# Altium project obdh2_project.prjpcb (part 2 of 2)
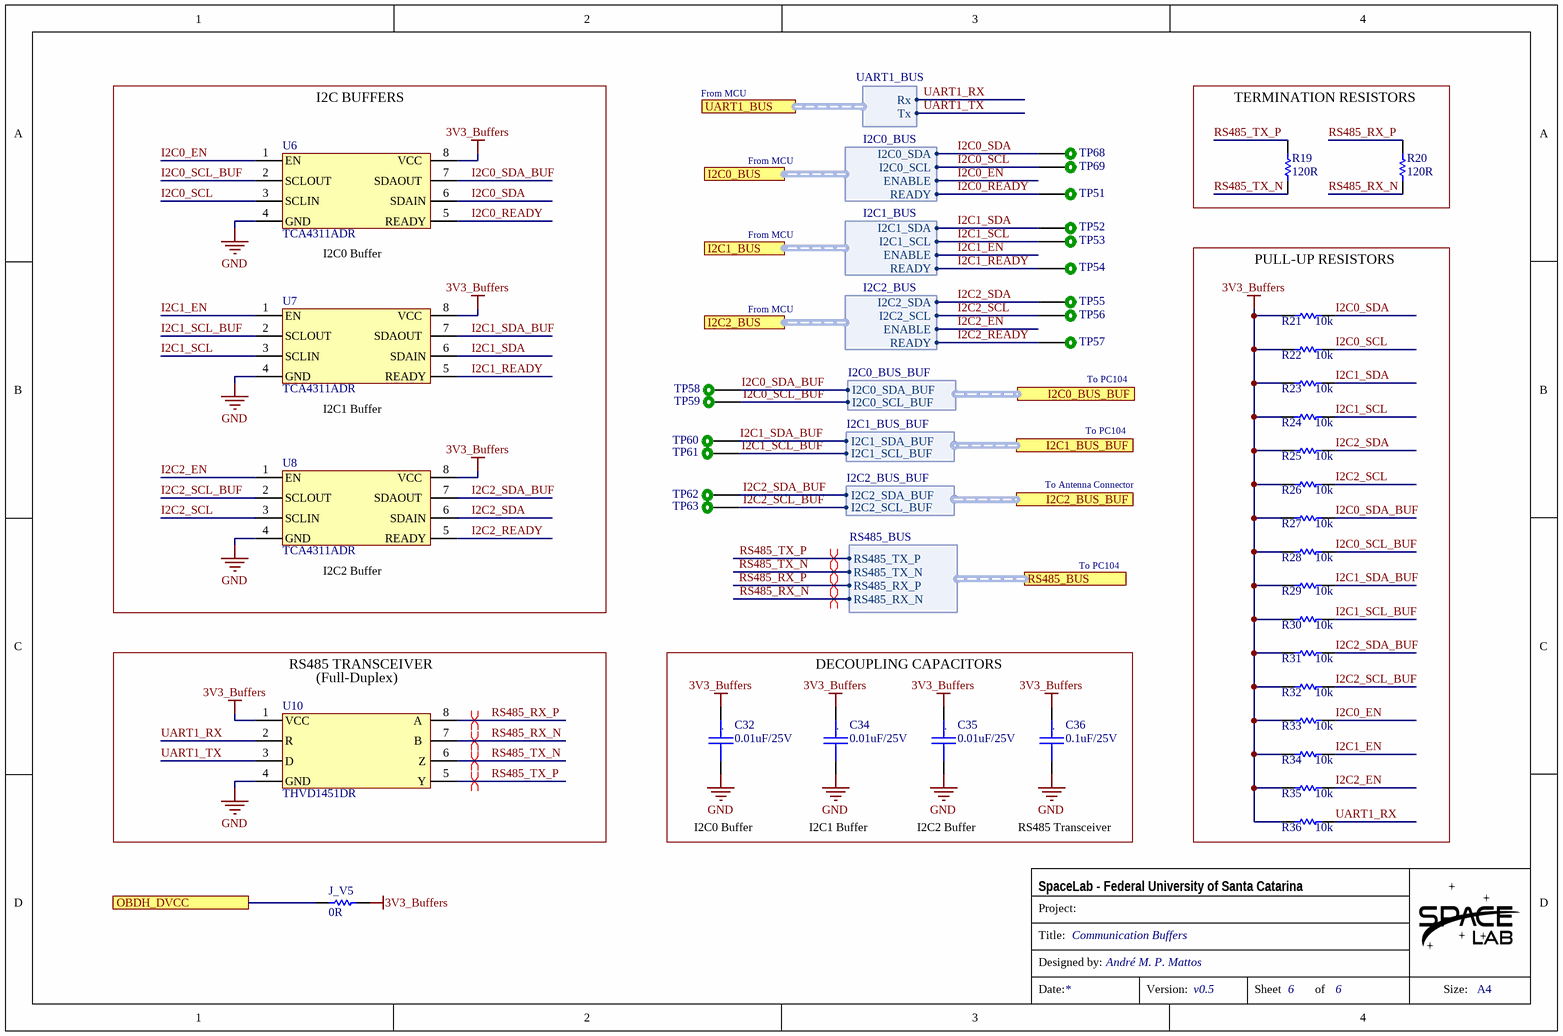
[diagram p7: 6_communication_buffers.schdoc]

## Nets that join several sheets
AGND: 3_mcu_main (U9.10 U9.12 U9.15 U9.83), 4_analog_circuits (20 pins)
ANTENNA_VCC: 1_interface (7 pins), 4_analog_circuits (C23.1 C24.1 R12.2 TP44.1)
GND: 0_architecture (MEC8.0), 1_interface (16 pins), 3_mcu_main (19 pins), 4_analog_circuits (15 pins), 5_non_volatile_memory (7 pins), 6_communication_buffers (8 pins)
OBDH_AVCC: 3_mcu_main (U9.11), 4_analog_circuits (12 pins)
OBDH_DVCC: 1_interface (P3.1), 3_mcu_main (6 pins), 4_analog_circuits (14 pins), 5_non_volatile_memory (J_V4.2), 6_communication_buffers (J_V5.2)
~{MR}_WDOG: 3_mcu_main (TP8.1 U9.75), 4_analog_circuits (R38.2 U1.3)
ANTENNA_GPIO: 1_interface (P4.5 P5.5), 3_mcu_main (U9.67)
COMMON_VCC: 1_interface (J_V0.2 P6.2), 4_analog_circuits (C13.1 RSense.1 TP45.1)
D_BOARD_ADC0: 1_interface (P3.12), 3_mcu_main (U9.97)
D_BOARD_ADC1: 1_interface (P3.14), 3_mcu_main (U9.98)
D_BOARD_ADC2: 1_interface (P3.16), 3_mcu_main (TP37.1 U9.99)
D_BOARD_GPIO0: 1_interface (P3.7), 3_mcu_main (U9.5)
D_BOARD_GPIO1: 1_interface (P3.8), 3_mcu_main (U9.6)
D_BOARD_GPIO2: 1_interface (P3.9), 3_mcu_main (TP35.1 U9.7)
D_BOARD_GPIO3: 1_interface (P3.10), 3_mcu_main (TP36.1 U9.8)
D_BOARD_SPI_CS0: 1_interface (P3.17), 3_mcu_main (TP38.1 U9.2)
D_BOARD_SPI_CS1: 1_interface (P3.19), 3_mcu_main (TP39.1 U9.3)
ESD: 0_architecture (MEC4.0), 1_interface (R_ESD.2)
FRAM_SPI_CS: 3_mcu_main (U9.69), 5_non_volatile_memory (R39.1 U11.1)
FRAM_WP: 3_mcu_main (U9.68), 5_non_volatile_memory (R40.1 U11.3)
I2C0_EN: 3_mcu_main (U9.42), 6_communication_buffers (R33.1 U6.1)
I2C0_READY: 3_mcu_main (U9.45), 6_communication_buffers (TP51.1 U6.5)
I2C0_SCL: 3_mcu_main (U9.19), 6_communication_buffers (R22.1 TP69.1 U6.3)
I2C0_SCL_BUF: 1_interface (J_PC2.2 U16.H1-43), 6_communication_buffers (R28.1 TP59.1 U6.2)
I2C0_SDA: 3_mcu_main (U9.18), 6_communication_buffers (R21.1 TP68.1 U6.6)
I2C0_SDA_BUF: 1_interface (J_PC1.2 U16.H1-41), 6_communication_buffers (R27.1 TP58.1 U6.7)
I2C1_EN: 3_mcu_main (U9.43), 6_communication_buffers (R34.1 U7.1)
I2C1_READY: 3_mcu_main (U9.46), 6_communication_buffers (TP54.1 U7.5)
I2C1_SCL: 3_mcu_main (U9.66), 6_communication_buffers (R24.1 TP53.1 U7.3)
I2C1_SCL_BUF: 1_interface (J_PC4.2 U16.H2-51), 6_communication_buffers (R30.1 TP61.1 U7.2)
I2C1_SDA: 3_mcu_main (U9.65), 6_communication_buffers (R23.1 TP52.1 U7.6)
I2C1_SDA_BUF: 1_interface (J_PC3.2 U16.H2-49), 6_communication_buffers (R29.1 TP60.1 U7.7)
I2C2_EN: 3_mcu_main (U9.44), 6_communication_buffers (R35.1 U8.1)
I2C2_READY: 3_mcu_main (U9.47), 6_communication_buffers (TP57.1 U8.5)
I2C2_SCL: 3_mcu_main (U9.74), 6_communication_buffers (R26.1 TP56.1 U8.3)
I2C2_SCL_BUF: 1_interface (P3.20 P4.4 P5.4), 6_communication_buffers (R32.1 TP63.1 U8.2)
I2C2_SDA: 3_mcu_main (U9.73), 6_communication_buffers (R25.1 TP55.1 U8.6)
I2C2_SDA_BUF: 1_interface (P3.18 P4.3 P5.3), 6_communication_buffers (R31.1 TP62.1 U8.7)
JTAG_TCK: 1_interface (P1.3 P2.7), 3_mcu_main (TP1.1 U9.91)
JTAG_TDO_TDI: 1_interface (P1.2 P2.1), 3_mcu_main (C1.1 R1.1 TP2.1 U9.96), 4_analog_circuits (R8.2)
MAIN_RADIO_ENABLE: 1_interface (U16.H1-12), 3_mcu_main (TP32.1 U9.34)
MAIN_RADIO_GPIO0: 1_interface (U16.H1-7), 3_mcu_main (TP28.1 U9.35)
MAIN_RADIO_GPIO1: 1_interface (U16.H1-8), 3_mcu_main (TP29.1 U9.36)
MAIN_RADIO_GPIO2: 1_interface (U16.H1-9), 3_mcu_main (TP30.1 U9.37)
MAIN_RADIO_RESET: 1_interface (U16.H1-11), 3_mcu_main (TP31.1 U9.38)
MAIN_RADIO_SPI_CS: 1_interface (U16.H1-40), 3_mcu_main (TP33.1 U9.39)
MEM_HOLD: 3_mcu_main (U9.52), 5_non_volatile_memory (R16.1 TP49.1 U5.1)
MEM_RESET: 3_mcu_main (U9.53), 5_non_volatile_memory (R17.1 TP50.1 U5.3)
MEM_SPI_CS: 3_mcu_main (U9.54), 5_non_volatile_memory (R14.1 TP47.1 U5.7)
OBDH_CURRENT_ADC: 3_mcu_main (TP6.1 U9.100), 4_analog_circuits (C14.1 R9.2 U3.2)
OBDH_VOLTAGE_ADC: 3_mcu_main (TP7.1 U9.1), 4_analog_circuits (C37.1 R37.2 U4.3 U4.4)
PAYLOAD_0_ENABLE: 1_interface (U16.H1-18), 3_mcu_main (TP41.1 U9.32)
PAYLOAD_1_ENABLE: 1_interface (U16.H1-20), 3_mcu_main (TP40.1 U9.33)
PC104_GPIO0: 1_interface (J_PC8.2), 3_mcu_main (U9.48)
PC104_GPIO1: 1_interface (J_PC9.2), 3_mcu_main (U9.49)
PC104_GPIO2: 1_interface (J_PC10.2), 3_mcu_main (U9.50)
PC104_GPIO3: 1_interface (J_PC11.2), 3_mcu_main (U9.51)
PC104_GPIO4: 1_interface (U16.H2-3), 3_mcu_main (U9.55)
PC104_GPIO5: 1_interface (U16.H2-4), 3_mcu_main (U9.56)
PC104_GPIO6: 1_interface (U16.H2-8), 3_mcu_main (U9.57)
RS485_RX_N: 1_interface (P8.2), 6_communication_buffers (R20.2 U10.7)
RS485_RX_P: 1_interface (P8.1), 6_communication_buffers (R20.1 U10.8)
RS485_TX_N: 1_interface (P8.3), 6_communication_buffers (R19.2 U10.6)
RS485_TX_P: 1_interface (P8.4), 6_communication_buffers (R19.1 U10.5)
SPI_CLK: 1_interface (J_PC7.2 P3.11 U16.H1-35 U16.H2-12), 3_mcu_main (TP5.1 U9.17), 5_non_volatile_memory (R18.1 U5.16 U11.6)
SPI_MISO: 1_interface (J_PC6.2 P3.13 U16.H1-37 U16.H2-14), 3_mcu_main (TP4.1 U9.22), 5_non_volatile_memory (U5.8 U11.2)
SPI_MOSI: 1_interface (J_PC5.2 P3.15 U16.H1-39 U16.H2-11), 3_mcu_main (TP3.1 U9.21), 5_non_volatile_memory (U5.15 U11.5)
TTC_MCU_SPI_CS: 1_interface (U16.H2-13), 3_mcu_main (TP34.1 U9.40)
UART0_RX: 1_interface (P1.5 P2.14 P7.2), 3_mcu_main (R5.2 U9.71)
UART0_TX: 1_interface (P1.4 P2.12 P7.1), 3_mcu_main (R4.2 U9.70)
UART1_RX: 1_interface (U16.H1-17), 3_mcu_main (R7.2 U9.61), 6_communication_buffers (R36.1 U10.2)
UART1_TX: 1_interface (U16.H1-19), 3_mcu_main (R6.2 U9.60), 6_communication_buffers (U10.3)
VREF: 3_mcu_main (U9.9), 4_analog_circuits (C12.1 J_V3.1 TP46.1 U2.6)
WDI_EXT: 3_mcu_main (TP9.1 U9.72), 4_analog_circuits (U1.4)

## Assembly variants
dnp_variant: not fitted D1 D2 D3 D4 D5 D6 D7 D8 J_PC1 J_PC2 J_PC3 J_PC4 J_PC5 J_PC6 J_PC7 J_PC8 J_PC9 J_PC10 J_PC11 J_V3 P2 P5 P6 P7 P8 R38